# EAGLE design incubadora-v1 (EAGLE 6.3)
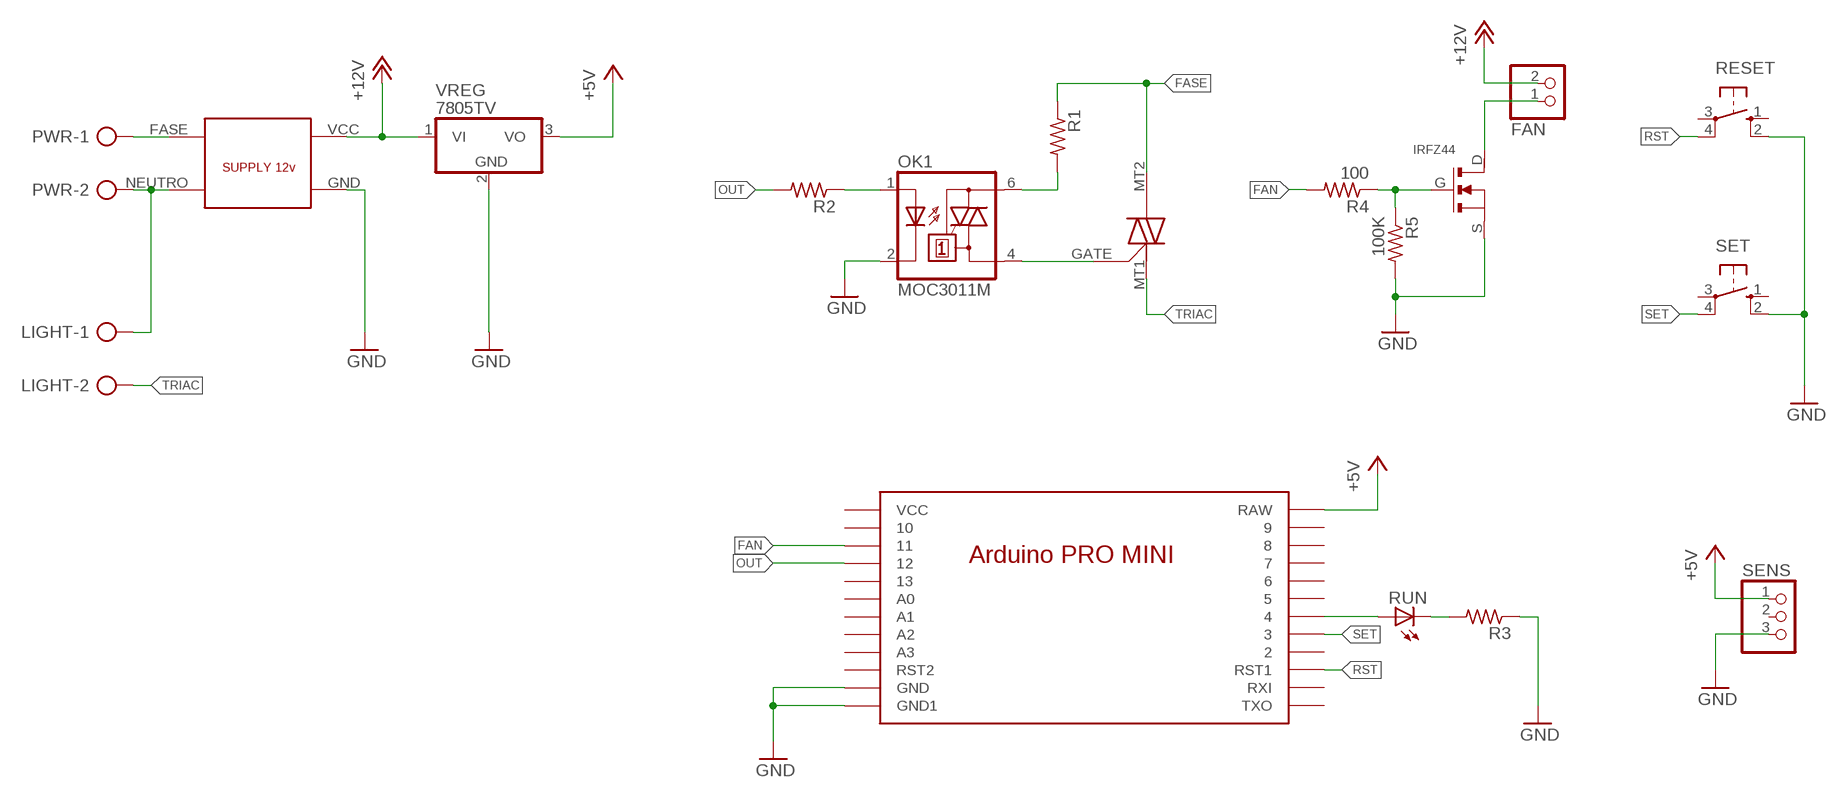
[diagram p0: schematic, sheet 1]

## Parts
FAN  PINHD-1X2/90  [1X02/90]
IRFZ44  IRFZ44  [IRFZ44]
LIGHT  AK300/2  [AK300/2]
OK1  MOC3011M  [DIL06]
PWR  AK300/2  [AK300/2]
R1  R-US_0204/7  [0204/7]
R2  R-US_0204/7  [0204/7]
R3  R-US_0204/7  [0204/7]
R4  100  R-US_0204/7  [0204/7]
R5  100K  R-US_0204/7  [0204/7]
RESET  10-XX  [B3F-10XX]
RUN  LED5MM  [LED5MM]
SENS  PINHD-1X3/90  [1X03/90]
SET  10-XX  [B3F-10XX]
TRIAC  MAC12  [MAC12]
U$1  NANO  [NANO]
U$3  SUPPLY12V  [SUPPLY12V]
VREG  7805TV  [TO220V]

## Nets
+5V: SENS.1 U$1.RAW VREG.3(VO)
+12V: FAN.2 U$3.VCC VREG.1(VI)
FAN: R4.2 U$1.11
FASE: PWR.1 R1.1 TRIAC.MT2 U$3.FASE
GND: IRFZ44.S OK1.2(C) R3.1 R5.2 RESET.2(S1) SENS.3 SET.2(S1) U$1.GND1(GND) U$1.GND2(GND1) U$3.GND VREG.2(GND)
N$1: RUN.A U$1.4
N$2: OK1.1(A) R2.1
N$5: R3.2 RUN.K(C)
N$9: LIGHT.1 PWR.2 U$3.NEUTRO
N$10: OK1.6(A2) R1.2
N$11: IRFZ44.G R4.1 R5.1
N$12: FAN.1 IRFZ44.D
N$14: OK1.4(A1) TRIAC.GATE
OUT: R2.2 U$1.12
RST: RESET.4(P1) U$1.RST1
SET: SET.4(P1) U$1.3
TRIAC: LIGHT.2 TRIAC.MT1
Unconnected: RESET.1(S) RESET.3(P) SENS.2 SET.1(S) SET.3(P) U$1.2 U$1.5 U$1.6 U$1.7 U$1.8 U$1.9 U$1.10 U$1.13 U$1.A0 U$1.A1 U$1.A2 U$1.A3 U$1.RST2 U$1.RXI U$1.TXO U$1.VCC

## Library data of the parts
FAN = pinhead:PINHD-1X2: PIN HEADER
IRFZ44 = E-Lab:IRFZ44
LIGHT PWR = con-ptr500:AK300/2: CONNECTOR; OC_FARNELL: unknown; OC_NEWARK: unknown
OK1 = optocoupler:MOC30*M: RANDOM-PHASE OPTOISOLATORS TRIAC DRIVER OUTPUT Source: http://www.fairchildsemi.com MOC3020-M.pdf; MF: FAIRCHILD SEMICONDUCTOR; MPN: MOC3011-M; OC_FARNELL: 1021363; OC_NEWARK: 72K8893
R1-R5 = resistor:R-US_: RESISTOR, American symbol
RESET SET = switch-omron:10-XX: OMRON SWITCH; MPN: B3F-1000; OC_FARNELL: 176432; OC_NEWARK: 36M3542
RUN = led:LED: LED OSRAM: - CHIPLED LG R971, LG N971, LY N971, LG Q971, LY Q971, LO R971, LY R971 LH N974, LH R974 LS Q976, LO Q976, LY Q976 LO Q996 - Hyper CHIPLED LW Q18S LB Q993, LB Q99A, LB R99A - SideLED LS A670, LO A670, LY A670, LG A670, LP A670 LB A673, LV A673, LT A673, LW A673 LH A674 LY A675 LS A676, LA A676, LO A676, LY A676, LW A676 LS A679, LY A679, LG A679 - Hyper Micro SIDELED® LS Y876, LA Y876, LO Y876, LY Y876 LT Y87S - SmartLED LW L88C, LW L88S LB L89C, LB L89S, LG L890 LS L89K, LO L89K, LY L89K LS L896, LA L896, LO L896, LY L896 - TOPLED LS T670, LO T670, LY T670, LG T670, LP T670 LSG T670, LSP T670, LSY T670, LOP T670, LYG T670 LG T671, LOG T671, LSG T671 LB T673, LV T673, LT T673, LW T673 LH T674 LS T676, LA T676, LO T676, LY T676, LB T676, LH T676, LSB T676, LW T676 LB T67C, LV T67C, LT T67C, LS T67K, LO T67K, LY T67K, LW E67C LS E67B, LA E67B, LO E67B, LY E67B, LB E67C, LV E67C, LT E67C LW T67C LS T679, LY T679, LG T679 LS T770, LO T770, LY T770, LG T770, LP T770 LB T773, LV T773, LT T773, LW T773 LH T774 LS E675, LA E675, LY E675, LS T675 LS T776, LA T776, LO T776, LY T776, LB T776 LHGB T686 LT T68C, LB T68C - Hyper Mini TOPLED® LB M676 - Mini TOPLED Santana® LG M470 LS M47K, LO M47K, LY M47K Source: http://www.osram.convergy.de LUXEON: - LUMILED® LXK2-PW12-R00, LXK2-PW12-S00, LXK2-PW14-U00, LXK2-PW14-V00 LXK2-PM12-R00, LXK2-PM12-S00, LXK2-PM14-U00 LXK2-PE12-Q00, LXK2-PE12-R00, LXK2-PE12-S00, LXK2-PE14-T00, LXK2-PE14-U00 LXK2-PB12-K00, LXK2-PB12-L00, LXK2-PB12-M00, LXK2-PB14-N00, LXK2-PB14-P00, LXK2-PB14-Q00 LXK2-PR12-L00, LXK2-PR12-M00, LXK2-PR14-Q00, LXK2-PR14-R00 LXK2-PD12-Q00, LXK2-PD12-R00, LXK2-PD12-S00 LXK2-PH12-R00, LXK2-PH12-S00 LXK2-PL12-P00, LXK2-PL12-Q00, LXK2-PL12-R00 Source: www.luxeon.com KINGBRIGHT: KA-3528ASYC Source: www.kingbright.com
SENS = pinhead:PINHD-1X3: PIN HEADER
TRIAC = E-Lab:MAC12
U$1 = E-Lab:NANO
U$3 = E-Lab:SUPPLY12V
VREG = linear:78*: Positive VOLTAGE REGULATOR Source: http://cache.national.com/ds/LM/LM78L05.pdf http://www.fairchildsemi.com/ds/LM/LM7805.pdf

## Board
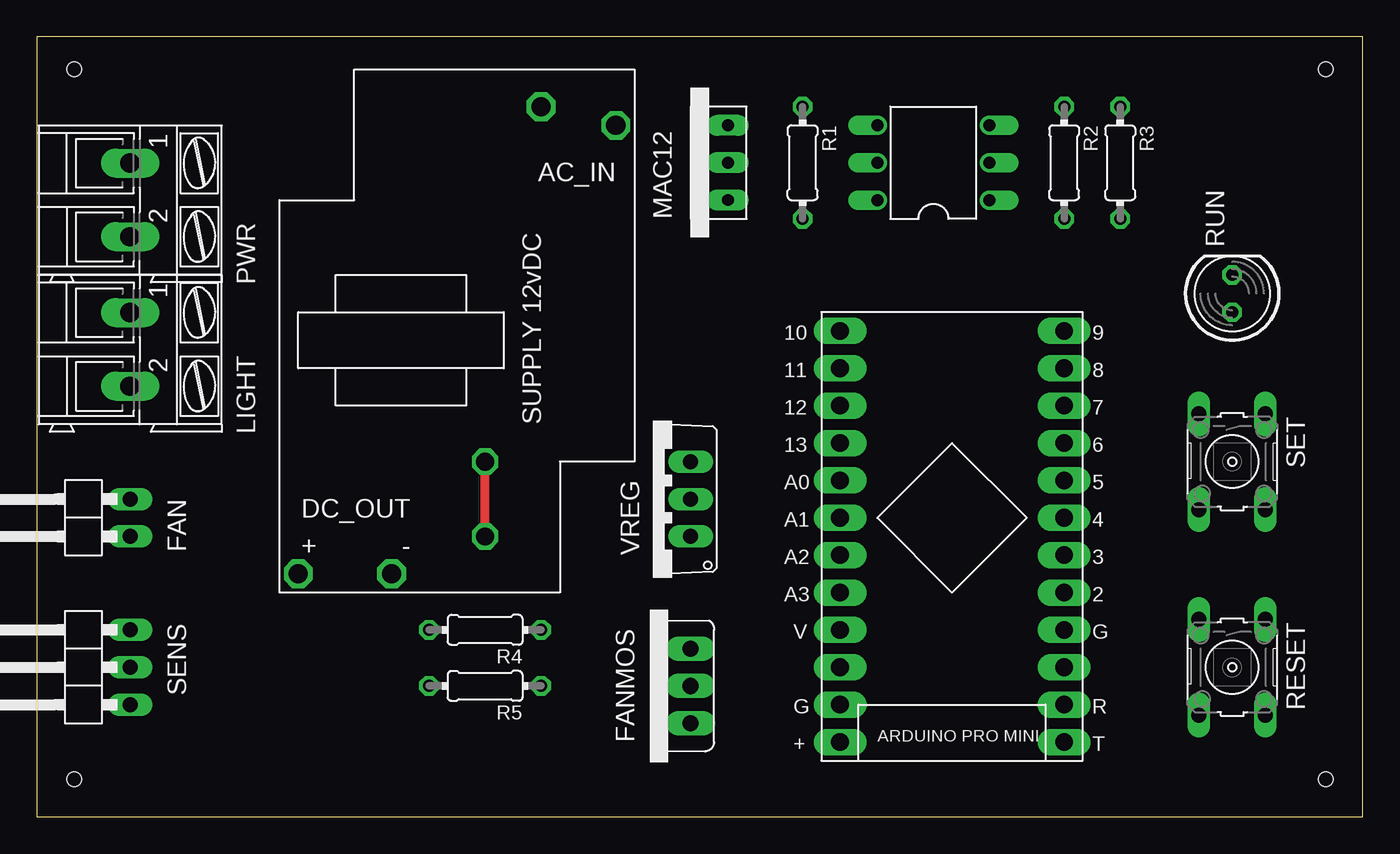
[diagram p1: board, top side]
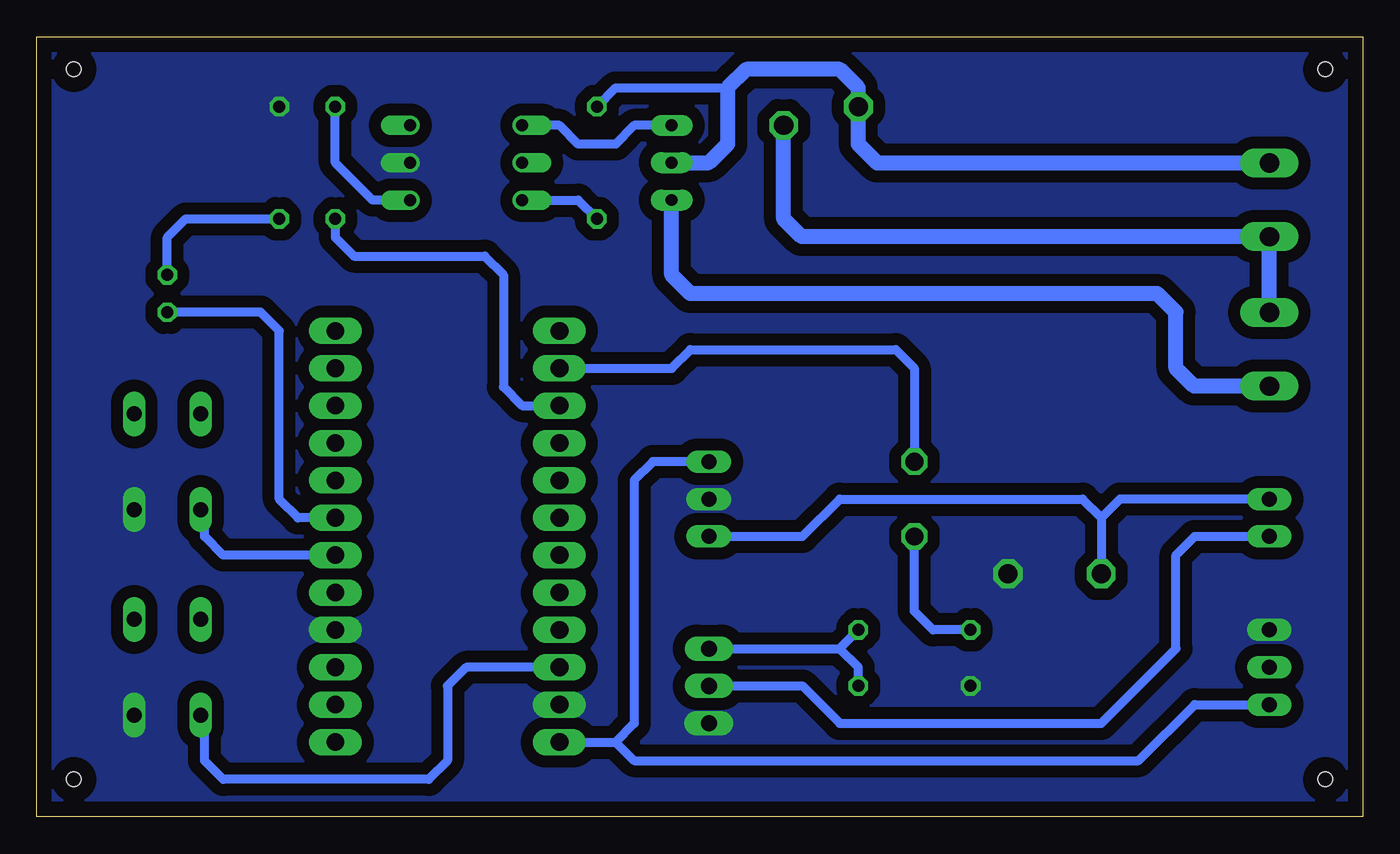
[diagram p2: board, bottom side, seen from below]

Size 90.15 x 53.01 mm. Coordinates in mm from the lower left corner, seen from the top.
Outline: 0,0 90.15,0 90.15,53.01 0,53.01 0,0
Copper layers (1*16): Top 0.035mm / dielectric 1.5mm / Bottom 0.035mm
Design rules "default": minimum track width 10mil, minimum drill 24mil, track to track 8mil, track to pad 8mil, pad to pad 8mil, via to via 8mil, smd to smd 8mil, copper to edge 40mil, drill to drill 8mil, minimum pad ring 10mil, minimum via ring 8mil, stop-mask expansion 4mil, vias tented up to drill 0mil, thermal gap 10mil
Holes 1 mm at 2.54,50.8 2.54,2.54 87.63,2.54 87.63,50.8

### Footprints (pad centres in the part's own frame; a part is rotated, then mirrored left to right if it is on the bottom)
1X02/90 = drill 1.016 long: 1 -1.27,-3.81; 2 1.27,-3.81
IRFZ44 = drill 1.1 long: D 0,0; G 2.534,0.006; S -2.534,-0.006
AK300/2 = drill 1.321 long: 1 -2.515,0; 2 2.489,0
DIL06 = drill 0.813 offset: 1 -2.54,-3.81; 2 0,-3.81; 3 2.54,-3.81; 4 2.54,3.81; 5 0,3.81; 6 -2.54,3.81
0204/7 = drill 0.813 octagon: 1 -3.81,0; 2 3.81,0
B3F-10XX = drill 1.016 long: 1 -3.251,2.261; 2 3.251,2.261; 3 -3.251,-2.261; 4 3.251,-2.261
LED5MM = drill 0.813 octagon: A -1.27,0; K 1.27,0
1X03/90 = drill 1.016 long: 1 -2.54,-3.81; 2 0,-3.81; 3 2.54,-3.81
MAC12 = drill 0.8 pad 1.422 long: GATE 2.54,0; MT1 -2.54,0; MT2 0,0
NANO = drill 1.2 long: 2 7.62,-5.08; 3 7.62,-2.54; 4 7.62,0; 5 7.62,2.54; 6 7.62,5.08; 7 7.62,7.62; 8 7.62,10.16; 9 7.62,12.7; 10 -7.62,12.7; 11 -7.62,10.16; 12 -7.62,7.62; 13 -7.62,5.08; A0 -7.62,2.54; A1 -7.62,0; A2 -7.62,-2.54; A3 -7.62,-5.08; GND1 -7.62,-12.7; GND2 7.62,-7.62; RAW -7.62,-15.24; RST1 -7.62,-10.16; RST2 7.62,-10.16; RXI 7.62,-12.7; TXO 7.62,-15.24; VCC -7.62,-7.62
SUPPLY12V = drill 1.3 octagon: FASE 15.24,-5.08; GND -16.51,5.08; NEUTRO 13.97,-10.16; VCC -16.51,11.43
TO220V = drill 1.016 long: 1 -2.54,-2.54; 2 0,-2.54; 3 2.54,-2.54

### Placement (x,y rotation side)
FAN  2.54,20.32 90 top
IRFZ44  44.45,8.89 90 top
LIGHT  6.35,31.75 270 top
OK1  60.96,44.45 90 top
PWR  6.35,41.91 270 top
R1  52.07,44.45 270 top
R2  69.85,44.45 270 top
R3  73.66,44.45 270 top
R4  30.48,12.7 180 top
R5  30.48,8.89 180 top
RESET  81.28,10.16 270 top
RUN  81.28,35.56 90 top
SENS  2.54,10.16 90 top
SET  81.28,24.13 270 top
TRIAC  46.99,44.45 90 top
U$1  62.23,20.32 0 top
U$3  29.21,33.02 90 top
VREG  41.91,21.59 90 top

### Tracks (layer width: path | path; a pad name or v marks a point on that pad's centre or on a via)
+5V
  Bottom 0.61: 7.62,7.62 SENS.1 11.43,7.62 15.24,3.81 49.53,3.81 50.8,5.08 | U$1.RAW 50.8,5.08 | VREG.3 48.26,24.13 49.53,22.86 49.53,6.35 50.8,5.08
+12V
  Bottom 0.61: FAN.2 16.51,21.59 17.78,20.32 | 17.78,20.32 U$3.VCC | 17.78,20.32 19.05,21.59 35.56,21.59 38.1,19.05 VREG.1
FAN  (via drill 1.2)
  Top 0.61: v30.48,19.05 v30.48,24.13
  Bottom 0.61: v30.48,19.05 30.48,13.97 29.21,12.7 R4.2 | U$1.11 46.99,30.48 45.72,31.75 31.75,31.75 30.48,30.48 v30.48,24.13
FASE
  Bottom 0.61: R1.1 50.8,49.53 43.18,49.53
  Bottom 1.016: PWR.1 32.99,44.42 34.29,45.72 U$3.FASE 34.29,49.53 35.56,50.8 41.91,50.8 43.18,49.53 43.18,45.72 44.45,44.45 TRIAC.MT2
GND
  pour Bottom (isolate 0.813, no thermals): 0,0 0,53.34 90.17,53.34 90.17,0
N$1
  Bottom 0.61: U$1.4 72.39,20.32 73.66,21.59 73.66,33.02 74.93,34.29 RUN.A
N$2
  Bottom 0.61: OK1.1 67.31,41.91 69.85,44.45 R2.1
N$5
  Bottom 0.61: RUN.K 81.28,39.37 80.01,40.64 R3.2
N$9
  Bottom 1.016: U$3.NEUTRO 39.37,40.64 38.15,39.42 PWR.2 LIGHT.1
N$10
  Bottom 0.61: OK1.6 53.34,41.91 R1.2
N$11
  Bottom 0.61: IRFZ44.G 35.57,11.42 | R4.1 35.57,11.42 | R5.1 34.29,10.15 35.57,11.42
N$12
  Bottom 0.61: IRFZ44.D 38.1,8.89 35.56,6.35 17.78,6.35 12.7,11.43 12.7,17.78 11.43,19.05 FAN.1
N$14
  Bottom 0.61: TRIAC.GATE 49.53,46.99 50.8,45.72 53.34,45.72 54.61,46.99 OK1.4
OUT
  Bottom 0.61: R2.2 69.85,39.37 68.58,38.1 59.69,38.1 58.42,36.83 58.42,29.21 57.15,27.94 U$1.12
RST
  Bottom 0.61: U$1.RST1 60.96,10.16 62.23,8.89 62.23,3.81 63.5,2.54 77.47,2.54 78.74,3.81 78.74,6.63 RESET.4
SET
  Bottom 0.61: U$1.3 77.47,17.78 78.74,19.05 78.74,20.6 SET.4
TRIAC
  Bottom 1.016: LIGHT.2 11.48,29.26 12.7,30.48 12.7,34.29 13.97,35.56 45.72,35.56 46.99,36.83 TRIAC.MT1

### Text on the board
tPlace: FANMOS